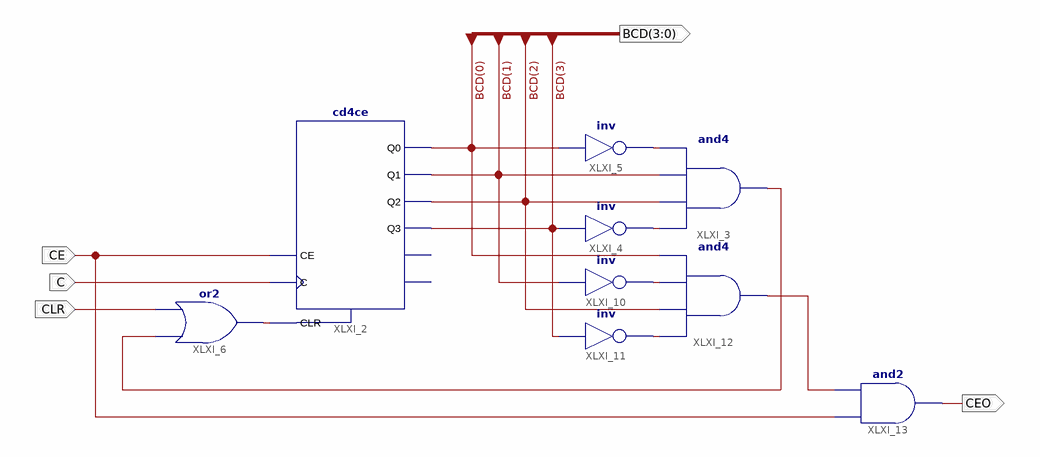
[diagram p0: schematic sheet 1]
// Xilinx ISE schematic Counter6BCD.sch (spartan6) as structural Verilog: 9 symbols, 5 ports
module Counter6BCD (
  input  CE,
  input  CLR,
  input  C,
  output [3:0] BCD,
  output CEO
);

  wire XLXN_6, XLXN_10, XLXN_11, XLXN_34, XLXN_40, XLXN_41, XLXN_57;

  and XLXI_3 (XLXN_34, XLXN_6, BCD[2], BCD[1], XLXN_10);
  not XLXI_4 (XLXN_6, BCD[3]);
  not XLXI_5 (XLXN_10, BCD[0]);
  and XLXI_13 (CEO, CE, XLXN_57);
  cd4ce XLXI_2 (.C(C), .CE(CE), .CLR(XLXN_11), .Q0(BCD[0]), .Q1(BCD[1]), .Q2(BCD[2]), .Q3(BCD[3]));  // open: CEO, TC
  or XLXI_6 (XLXN_11, XLXN_34, CLR);
  and XLXI_12 (XLXN_57, XLXN_41, BCD[2], XLXN_40, BCD[0]);
  not XLXI_10 (XLXN_40, BCD[1]);
  not XLXI_11 (XLXN_41, BCD[3]);
endmodule
